# Altium project PCB_F2838_Node.PrjPcb (part 5 of 5)

## Sheet [8] CONNECTORS MECH.SchDoc
size 431 x 279 mm; SheetNumber: 9; SheetTotal: 9
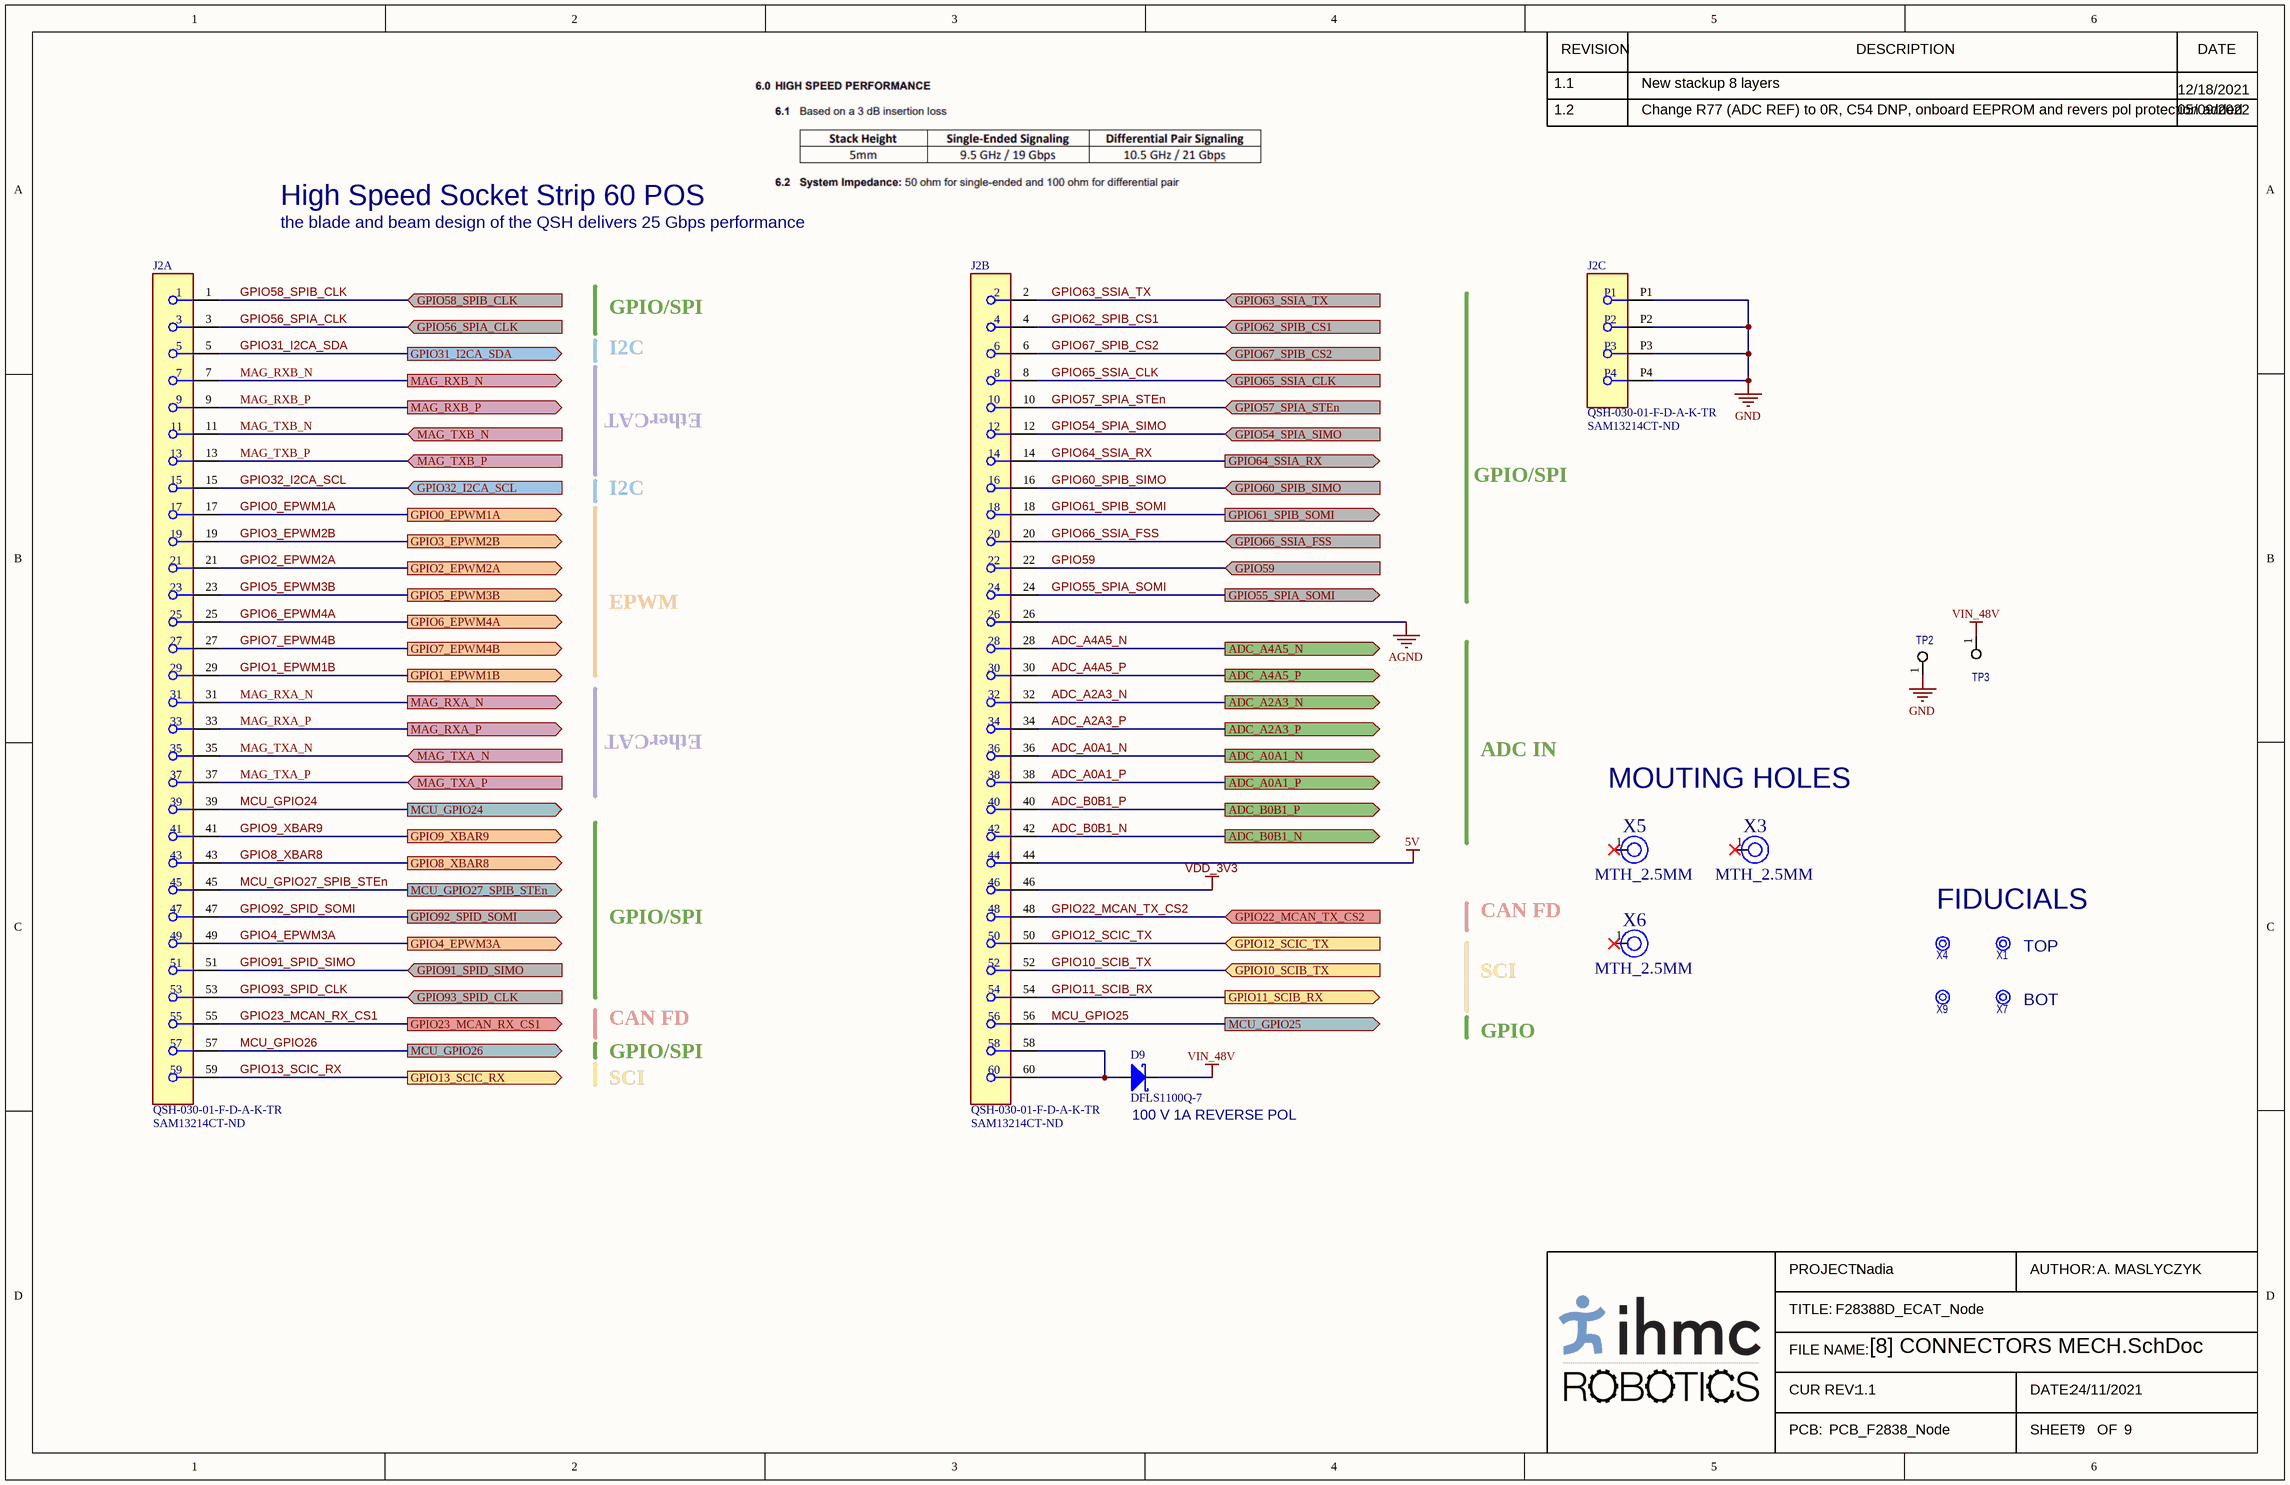
[diagram p8: [8] CONNECTORS MECH.SchDoc]

### Parts
D9  DFLS1100Q-7  [DI_123]
J2  QSH-030-01-F-D-A-K-TR  Supplier Part Number 1: SAM13214CT-ND  [FP-QSH-030-01-F-D-A-K-TR-MFG]  (parts A,B,C of 3)
TP2  TP_SMD  [TP_5019]  (value not drawn)  (no BOM)
TP3  TP_SMD  [TP_5019]  (value not drawn)  (no BOM)
X1  FIDUCIAL  [FIDUCIAL]  (value not drawn)  (no BOM)
X3  MTH_2.5MM  [MTH-M2.5mm]  (no BOM)
X4  FIDUCIAL  [FIDUCIAL]  (value not drawn)  (no BOM)
X5  MTH_2.5MM  [MTH-M2.5mm]  (no BOM)
X6  MTH_2.5MM  [MTH-M2.5mm]  (no BOM)
X7  FIDUCIAL  [FIDUCIAL]  (value not drawn)  (no BOM)
X9  FIDUCIAL  [FIDUCIAL]  (value not drawn)  (no BOM)

### Ports
ADC_A0A1_N (out), ADC_A0A1_P (out), ADC_A2A3_N (out), ADC_A2A3_P (out), ADC_A4A5_N (out), ADC_A4A5_P (out), ADC_B0B1_N (out), ADC_B0B1_P (out), GPIO0_EPWM1A (out), GPIO1_EPWM1B (out), GPIO2_EPWM2A (out), GPIO3_EPWM2B (out), GPIO4_EPWM3A (out), GPIO5_EPWM3B (out), GPIO6_EPWM4A (out), GPIO7_EPWM4B (out), GPIO8_XBAR8 (out), GPIO9_XBAR9 (out), GPIO10_SCIB_TX (in), GPIO11_SCIB_RX (out), GPIO12_SCIC_TX (in), GPIO13_SCIC_RX (out), GPIO22_MCAN_TX_CS2 (in), GPIO23_MCAN_RX_CS1 (out), GPIO31_I2CA_SDA (out), GPIO32_I2CA_SCL (in), GPIO54_SPIA_SIMO (in), GPIO55_SPIA_SOMI (out), GPIO56_SPIA_CLK (in), GPIO57_SPIA_STEn (in), GPIO58_SPIB_CLK (in), GPIO59 (in), GPIO60_SPIB_SIMO (in), GPIO61_SPIB_SOMI (out), GPIO62_SPIB_CS1 (in), GPIO63_SSIA_TX (in), GPIO64_SSIA_RX (out), GPIO65_SSIA_CLK (in), GPIO66_SSIA_FSS (in), GPIO67_SPIB_CS2 (in), GPIO91_SPID_SIMO (in), GPIO92_SPID_SOMI (out), GPIO93_SPID_CLK (in), MAG_RXA_N (out), MAG_RXA_P (out), MAG_RXB_N (out), MAG_RXB_P (out), MAG_TXA_N (in), MAG_TXA_P (in), MAG_TXB_N (in), MAG_TXB_P (in), MCU_GPIO24 (out), MCU_GPIO25 (out), MCU_GPIO26 (out), MCU_GPIO27_SPIB_STEn (out)

### Nets
5V: J2.44
AGND: J2.26
GND: J2.P1 J2.P2 J2.P3 J2.P4 TP2.1(IN)
VDD_3V3: J2.46
VIN_48V: D9.1(K) TP3.1(IN)
ADC_A0A1_N: J2.36 ; port ADC_A0A1_N
ADC_A0A1_P: J2.38 ; port ADC_A0A1_P
ADC_A2A3_N: J2.32 ; port ADC_A2A3_N
ADC_A2A3_P: J2.34 ; port ADC_A2A3_P
ADC_A4A5_N: J2.28 ; port ADC_A4A5_N
ADC_A4A5_P: J2.30 ; port ADC_A4A5_P
ADC_B0B1_N: J2.42 ; port ADC_B0B1_N
ADC_B0B1_P: J2.40 ; port ADC_B0B1_P
GPIO0_EPWM1A: J2.17 ; port GPIO0_EPWM1A
GPIO1_EPWM1B: J2.29 ; port GPIO1_EPWM1B
GPIO2_EPWM2A: J2.21 ; port GPIO2_EPWM2A
GPIO3_EPWM2B: J2.19 ; port GPIO3_EPWM2B
GPIO4_EPWM3A: J2.49 ; port GPIO4_EPWM3A
GPIO5_EPWM3B: J2.23 ; port GPIO5_EPWM3B
GPIO6_EPWM4A: J2.25 ; port GPIO6_EPWM4A
GPIO7_EPWM4B: J2.27 ; port GPIO7_EPWM4B
GPIO8_XBAR8: J2.43 ; port GPIO8_XBAR8
GPIO9_XBAR9: J2.41 ; port GPIO9_XBAR9
GPIO10_SCIB_TX: J2.52 ; port GPIO10_SCIB_TX
GPIO11_SCIB_RX: J2.54 ; port GPIO11_SCIB_RX
GPIO12_SCIC_TX: J2.50 ; port GPIO12_SCIC_TX
GPIO13_SCIC_RX: J2.59 ; port GPIO13_SCIC_RX
GPIO22_MCAN_TX_CS2: J2.48 ; port GPIO22_MCAN_TX_CS2
GPIO23_MCAN_RX_CS1: J2.55 ; port GPIO23_MCAN_RX_CS1
GPIO31_I2CA_SDA: J2.5 ; port GPIO31_I2CA_SDA
GPIO32_I2CA_SCL: J2.15 ; port GPIO32_I2CA_SCL
GPIO54_SPIA_SIMO: J2.12 ; port GPIO54_SPIA_SIMO
GPIO55_SPIA_SOMI: J2.24 ; port GPIO55_SPIA_SOMI
GPIO56_SPIA_CLK: J2.3 ; port GPIO56_SPIA_CLK
GPIO57_SPIA_STEn: J2.10 ; port GPIO57_SPIA_STEn
GPIO58_SPIB_CLK: J2.1 ; port GPIO58_SPIB_CLK
GPIO59: J2.22 ; port GPIO59
GPIO60_SPIB_SIMO: J2.16 ; port GPIO60_SPIB_SIMO
GPIO61_SPIB_SOMI: J2.18 ; port GPIO61_SPIB_SOMI
GPIO62_SPIB_CS1: J2.4 ; port GPIO62_SPIB_CS1
GPIO63_SSIA_TX: J2.2 ; port GPIO63_SSIA_TX
GPIO64_SSIA_RX: J2.14 ; port GPIO64_SSIA_RX
GPIO65_SSIA_CLK: J2.8 ; port GPIO65_SSIA_CLK
GPIO66_SSIA_FSS: J2.20 ; port GPIO66_SSIA_FSS
GPIO67_SPIB_CS2: J2.6 ; port GPIO67_SPIB_CS2
GPIO91_SPID_SIMO: J2.51 ; port GPIO91_SPID_SIMO
GPIO92_SPID_SOMI: J2.47 ; port GPIO92_SPID_SOMI
GPIO93_SPID_CLK: J2.53 ; port GPIO93_SPID_CLK
MAG_RXA_N: J2.31 ; port MAG_RXA_N
MAG_RXA_P: J2.33 ; port MAG_RXA_P
MAG_RXB_N: J2.7 ; port MAG_RXB_N
MAG_RXB_P: J2.9 ; port MAG_RXB_P
MAG_TXA_N: J2.35 ; port MAG_TXA_N
MAG_TXA_P: J2.37 ; port MAG_TXA_P
MAG_TXB_N: J2.11 ; port MAG_TXB_N
MAG_TXB_P: J2.13 ; port MAG_TXB_P
MCU_GPIO24: J2.39 ; port MCU_GPIO24
MCU_GPIO25: J2.56 ; port MCU_GPIO25
MCU_GPIO26: J2.57 ; port MCU_GPIO26
MCU_GPIO27_SPIB_STEn: J2.45 ; port MCU_GPIO27_SPIB_STEn
NetD9_2: D9.2(A) J2.58 J2.60

Not connected (* = marked no-connect by the designer): X3 1*; X5 1*; X6 1*

### Notes on the sheet
- High Speed Socket Strip 60 POS
- the blade and beam design of the QSH delivers 25 Gbps performance
- I2C
- GPIO/SPI
- EtherCAT
- EPWM
- ADC IN
- MOUTING HOLES
- CAN FD
- FIDUCIALS
- (near X1) TOP
- SCI
- (near X7) BOT
- GPIO
- (near D9) 100 V 1A REVERSE POL
- REVISION
- DESCRIPTION
- DATE
- PROJECT:
- AUTHOR:
- TITLE:
- FILE NAME:
- CUR REV:
- PCB:
- SHEET:
- DATE:
- OF

### Library data of the parts
D9 = DIODE_SCHOTTKY_100V_1A_DFLS1100Q-7: Rectifier Diode Schottky 100V 1A Automotive 2-Pin PowerDI 123 T/R; Manufacturer: Diodes; Supplier 1: Digi-Key; Manufacturer Part Number: DFLS1100Q-7; RoHS: Yes; Category: Rectifier Diodes; Stock 1: 12778; Pricing 1: 1=0.47000, 10=0.40100, 100=0.29960, 500=0.23540, 1000=0.18190 (USD); Mount: Surface Mount; Packaging: Tape and Reel; Average Rectified Current: 1A; Max Reverse Voltage (DC): 100V; RoHS Compliant: Yes; ComponentLink1URL: http://www.farnell.com/datasheets/2238295.pdf?src-supplier=Farnell; ComponentLink1Description: http://www.farnell.com/datasheets/2238295.pdf?src-supplier=Farnell; ComponentLink2URL: https://www.diodes.com/assets/Datasheets/ds30497.pdf?src-supplier=Digi-Key; ComponentLink2Description: https://www.diodes.com/assets/Datasheets/ds30497.pdf?src-supplier=Digi-Key; ComponentLink3URL: http://www.farnell.com/datasheets/2238295.pdf?src-supplier=Newark; ComponentLink3Description: http://www.farnell.com/datasheets/2238295.pdf?src-supplier=Newark; ComponentLink4URL: http://www.farnell.com/datasheets/2238295.pdf?src-supplier=Element14; ComponentLink4Description: http://www.farnell.com/datasheets/2238295.pdf?src-supplier=Element14; Supplier Part Number 1: DFLS1100Q-7DICT-ND
J2 = QSH-030-01-F-D-A_60PINS_CON: Conn Micro High Speed Socket Strip SKT 60 POS 0.5mm Solder ST SMD Automotive T/R; Manufacturer: Samtec; Voltage Rating (AC): 125V; Number of Contacts: 60; Gender: Female; Contact Plating: Gold; Pitch: 0.5mm; Housing Material: Polymer; Min Operating Temperature: -55°C; Termination: Solder; Radiation Hardening: No; Max Operating Temperature: 125°C; Length: 21.27mm; Depth: 7.49mm; Mount: Surface Mount; Max Voltage Rating (AC): 125V; Contact Material: Bronze; Lead Free: Lead Free; Orientation: Straight; Number of Rows: 2; Housing Color: Black; Packaging: Tape and Reel; Supplier 1: Digi-Key; Manufacturer Part Number: QSH-030-01-F-D-A-K-TR; RoHS: Yes; Category: Headers and Wire Housings; Stock 1: 520; Pricing 1: 1=9.59000, 10=9.17400, 25=8.34000, 50=7.92300, 100=7.71450, 250=6.88052 (USD); RoHS Compliant: Yes; ComponentLink1URL: https://datasheet.ciiva.com/9475/qsh-9475259.pdf?src-supplier=Avnet; ComponentLink1Description: https://datasheet.ciiva.com/9475/qsh-9475259.pdf?src-supplier=Avnet
TP2 TP3 = TP_SMD_1MM: Test point SMD
X3 X5 X6 = MTH_2.5MM: FORWARD_PCB: 1; STATUS: NOT INSTALLED; PKG_TYPE: MTH_2.5MM

## Nets that join several sheets
5V: [2] POWER (12 pins), [8] CONNECTORS MECH (J2.44)
AGND: [2] POWER (7 pins), [5] F2838 ADC (39 pins), [7] SENSORS (C48.1), [8] CONNECTORS MECH (J2.26)
GND: [2] POWER (128 pins), [4] F2838 JTAG CLOCK SUP (24 pins), [6] ETHERCAT (60 pins), [7] SENSORS (19 pins), [8] CONNECTORS MECH (5 pins)
VDD_1V2: [2] POWER (24 pins), [4] F2838 JTAG CLOCK SUP (U13.3)
VDD_3V3: [2] POWER (50 pins), [4] F2838 JTAG CLOCK SUP (28 pins), [6] ETHERCAT (73 pins), [7] SENSORS (13 pins), [8] CONNECTORS MECH (J2.46)
VDDA_3V3: [2] POWER (6 pins), [5] F2838 ADC (7 pins)
VIN_48V: [2] POWER (5 pins), [8] CONNECTORS MECH (D9.1 TP3.1)
ADC_A0A1_N: [5] F2838 ADC (R86.1), [8] CONNECTORS MECH (J2.36)
ADC_A0A1_P: [5] F2838 ADC (R87.1), [8] CONNECTORS MECH (J2.38)
ADC_A2A3_N: [5] F2838 ADC (R84.1), [8] CONNECTORS MECH (J2.32)
ADC_A2A3_P: [5] F2838 ADC (R85.1), [8] CONNECTORS MECH (J2.34)
ADC_A4A5_N: [5] F2838 ADC (R82.1), [8] CONNECTORS MECH (J2.28)
ADC_A4A5_P: [5] F2838 ADC (R83.1), [8] CONNECTORS MECH (J2.30)
ADC_B0B1_N: [5] F2838 ADC (R81.1), [8] CONNECTORS MECH (J2.42)
ADC_B0B1_P: [5] F2838 ADC (R88.1), [8] CONNECTORS MECH (J2.40)
GPIO0_EPWM1A: [3] F2838 GPIO (U8.C8), [8] CONNECTORS MECH (J2.17)
GPIO1_EPWM1B: [3] F2838 GPIO (U8.D8), [8] CONNECTORS MECH (J2.29)
GPIO2_EPWM2A: [3] F2838 GPIO (U8.A7), [8] CONNECTORS MECH (J2.21)
GPIO3_EPWM2B: [3] F2838 GPIO (U8.B7), [8] CONNECTORS MECH (J2.19)
GPIO4_EPWM3A: [3] F2838 GPIO (U8.C7), [8] CONNECTORS MECH (J2.49)
GPIO5_EPWM3B: [3] F2838 GPIO (U8.D7), [8] CONNECTORS MECH (J2.23)
GPIO6_EPWM4A: [3] F2838 GPIO (U8.A6), [8] CONNECTORS MECH (J2.25)
GPIO7_EPWM4B: [3] F2838 GPIO (U8.B6), [8] CONNECTORS MECH (J2.27)
GPIO8_XBAR8: [3] F2838 GPIO (U8.G2), [8] CONNECTORS MECH (J2.43)
GPIO9_XBAR9: [3] F2838 GPIO (U8.G3), [8] CONNECTORS MECH (J2.41)
GPIO10_SCIB_TX: [3] F2838 GPIO (U8.B2), [8] CONNECTORS MECH (J2.52)
GPIO11_SCIB_RX: [3] F2838 GPIO (U8.C1), [8] CONNECTORS MECH (J2.54)
GPIO12_SCIC_TX: [3] F2838 GPIO (U8.C2), [8] CONNECTORS MECH (J2.50)
GPIO13_SCIC_RX: [3] F2838 GPIO (U8.D1), [8] CONNECTORS MECH (J2.59)
GPIO22_MCAN_TX_CS2: [3] F2838 GPIO (U8.J4), [8] CONNECTORS MECH (J2.48)
GPIO23_MCAN_RX_CS1: [3] F2838 GPIO (U8.K4), [8] CONNECTORS MECH (J2.55)
GPIO28_PWM15_LED_RED: [3] F2838 GPIO (U8.V11), [4] F2838 JTAG CLOCK SUP (R18.1 U3.3)
GPIO29_PWM15_LED_GR: [3] F2838 GPIO (U8.W11), [4] F2838 JTAG CLOCK SUP (R14.1 U3.1)
GPIO31_I2CA_SDA: [3] F2838 GPIO (U8.U11), [8] CONNECTORS MECH (J2.5)
GPIO32_I2CA_SCL: [3] F2838 GPIO (U8.U13), [8] CONNECTORS MECH (J2.15)
GPIO34_I2CB_IMU_SDA: [3] F2838 GPIO (U8.U14), [7] SENSORS (R99.1 R102.1 U15.5)
GPIO35_I2CB_IMU_SCL: [3] F2838 GPIO (U8.T14), [7] SENSORS (R98.1 R100.2 R103.1)
GPIO51_OVERVOLTAGE: [3] F2838 GPIO (U8.R19), [4] F2838 JTAG CLOCK SUP (R76.2)
GPIO54_SPIA_SIMO: [3] F2838 GPIO (U8.P18), [8] CONNECTORS MECH (J2.12)
GPIO55_SPIA_SOMI: [3] F2838 GPIO (U8.P19), [8] CONNECTORS MECH (J2.24)
GPIO56_SPIA_CLK: [3] F2838 GPIO (U8.N16), [8] CONNECTORS MECH (J2.3)
GPIO57_SPIA_STEn: [3] F2838 GPIO (U8.N18), [8] CONNECTORS MECH (J2.10)
GPIO58_SPIB_CLK: [3] F2838 GPIO (U8.N17), [8] CONNECTORS MECH (J2.1)
GPIO59: [3] F2838 GPIO (U8.M16), [8] CONNECTORS MECH (J2.22)
GPIO60_SPIB_SIMO: [3] F2838 GPIO (U8.M17), [8] CONNECTORS MECH (J2.16)
GPIO61_SPIB_SOMI: [3] F2838 GPIO (U8.L16), [8] CONNECTORS MECH (J2.18)
GPIO62_SPIB_CS1: [3] F2838 GPIO (U8.J17), [8] CONNECTORS MECH (J2.4)
GPIO63_SSIA_TX: [3] F2838 GPIO (U8.J16), [8] CONNECTORS MECH (J2.2)
GPIO64_SSIA_RX: [3] F2838 GPIO (U8.L17), [8] CONNECTORS MECH (J2.14)
GPIO65_SSIA_CLK: [3] F2838 GPIO (U8.K16), [8] CONNECTORS MECH (J2.8)
GPIO66_SSIA_FSS: [3] F2838 GPIO (U8.K17), [8] CONNECTORS MECH (J2.20)
GPIO67_SPIB_CS2: [3] F2838 GPIO (U8.B19), [8] CONNECTORS MECH (J2.6)
GPIO91_SPID_SIMO: [3] F2838 GPIO (U8.B5), [8] CONNECTORS MECH (J2.51)
GPIO92_SPID_SOMI: [3] F2838 GPIO (U8.A4), [8] CONNECTORS MECH (J2.47)
GPIO93_SPID_CLK: [3] F2838 GPIO (U8.B4), [8] CONNECTORS MECH (J2.53)
GPIO98_SPIC_CS1: [3] F2838 GPIO (U8.F1), [7] SENSORS (U14.12)
GPIO100_SPIC_SIMO: [3] F2838 GPIO (U8.H1), [7] SENSORS (R102.2 U14.14)
GPIO101_SPIC_SOMI: [3] F2838 GPIO (U8.H2), [7] SENSORS (U14.1)
GPIO102_SPIC_CLK: [3] F2838 GPIO (U8.H3), [7] SENSORS (R103.2 U14.13)
GPIO104_IMU_INT1: [3] F2838 GPIO (U8.J2), [7] SENSORS (U14.4)
GPIO105_IMU_INT2: [3] F2838 GPIO (U8.J3), [7] SENSORS (R105.1 U14.9)
GPIO129_ESC_TX1_ENA: [3] F2838 GPIO (U8.T10), [6] ETHERCAT (U6.3)
GPIO130_ESC_TX1_CLK: [3] F2838 GPIO (U8.U10), [6] ETHERCAT (U6.2)
GPIO131_ESC_TX1_DATA0: [3] F2838 GPIO (U8.V10), [6] ETHERCAT (U6.4)
GPIO132_ESC_TX1_DATA1: [3] F2838 GPIO (U8.W18), [6] ETHERCAT (U6.5)
GPIO134_ESC_TX1_DATA2: [3] F2838 GPIO (U8.V18), [6] ETHERCAT (U6.6)
GPIO135_ESC_TX1_DATA3: [3] F2838 GPIO (U8.U18), [6] ETHERCAT (U6.7)
GPIO136_ESC_RX1_DV: [3] F2838 GPIO (U8.T17), [6] ETHERCAT (R49.2 U6.26)
GPIO137_ESC_RX1_CLK: [3] F2838 GPIO (U8.T18), [6] ETHERCAT (U6.25)
GPIO138_ESC_RX1_ERR: [3] F2838 GPIO (U8.T19), [6] ETHERCAT (R56.1 U6.28)
GPIO139_ESC_RX1_DATA0: [3] F2838 GPIO (U8.N19), [6] ETHERCAT (R51.2 U6.30)
GPIO140_ESC_RX1_DATA1: [3] F2838 GPIO (U8.M19), [6] ETHERCAT (R52.2 U6.31)
GPIO141_ESC_RX1_DATA2: [3] F2838 GPIO (U8.M18), [6] ETHERCAT (R53.2 U6.32)
GPIO142_ESC_RX1_DATA3: [3] F2838 GPIO (U8.L19), [6] ETHERCAT (R54.2 U6.1)
GPIO143_ESC_LED_LINK0_ACTIVE: [3] F2838 GPIO (U8.F18), [6] ETHERCAT (D4.3)
GPIO144_ESC_LED_LINK1_ACTIVE: [3] F2838 GPIO (U8.F17), [6] ETHERCAT (D5.3)
GPIO145_ESC_LED_ERR: [3] F2838 GPIO (U8.E17), [6] ETHERCAT (R90.2 U12.1)
GPIO146_ESC_LED_RUN: [3] F2838 GPIO (U8.D18), [6] ETHERCAT (R89.2 U12.3)
GPIO148_ESC_PHY0_LINKSTATUS: [3] F2838 GPIO (U8.D14), [6] ETHERCAT (D4.4 R39.1 U5.17)
GPIO149_ESC_PHY1_LINKSTATUS: [3] F2838 GPIO (U8.A13), [6] ETHERCAT (D5.4 R40.1 U6.17)
GPIO150_ESC_I2C_SDA: [3] F2838 GPIO (U8.B13), [6] ETHERCAT (R35.1 U4.5)
GPIO151_ESC_I2C_SCL: [3] F2838 GPIO (U8.C13), [6] ETHERCAT (R36.1 U4.6)
GPIO152_ESC_MDIO_CLK: [3] F2838 GPIO (U8.D13), [6] ETHERCAT (U5.20 U6.20)
GPIO153_ESC_MDIO_DATA: [3] F2838 GPIO (U8.A12), [6] ETHERCAT (R41.1 R42.1 U5.19 U6.19)
GPIO154_P0_PHY_CLK: [3] F2838 GPIO (U8.B12), [4] F2838 JTAG CLOCK SUP (R43.2 R47.2)
GPIO155_ESC_PHY_RESETn: [3] F2838 GPIO (U8.C12), [6] ETHERCAT (U5.18 U6.18)
GPIO156_ESC_TX0_ENA: [3] F2838 GPIO (U8.D12), [6] ETHERCAT (U5.3)
GPIO157_ESC_TX0_CLK: [3] F2838 GPIO (U8.B10), [6] ETHERCAT (U5.2)
GPIO158_ESC_TX0_DATA0: [3] F2838 GPIO (U8.C10), [6] ETHERCAT (U5.4)
GPIO159_ESC_TX0_DATA1: [3] F2838 GPIO (U8.D10), [6] ETHERCAT (U5.5)
GPIO160_ESC_TX0_DATA2: [3] F2838 GPIO (U8.B9), [6] ETHERCAT (U5.6)
GPIO161_ESC_TX0_DATA3: [3] F2838 GPIO (U8.C9), [6] ETHERCAT (U5.7)
GPIO162_ESC_RX0_DV: [3] F2838 GPIO (U8.D9), [6] ETHERCAT (R57.2 U5.26)
GPIO163_ESC_RX0_CLK: [3] F2838 GPIO (U8.A8), [6] ETHERCAT (U5.25)
GPIO164_ESC_RX0_ERR: [3] F2838 GPIO (U8.B8), [6] ETHERCAT (R59.1 U5.28)
GPIO165_ESC_RX0_DATA0: [3] F2838 GPIO (U8.C5), [6] ETHERCAT (R61.2 U5.30)
GPIO166_ESC_RX0_DATA1: [3] F2838 GPIO (U8.D5), [6] ETHERCAT (R62.2 U5.31)
GPIO167_ESC_RX0_DATA2: [3] F2838 GPIO (U8.C4), [6] ETHERCAT (R63.2 U5.32)
GPIO168_ESC_RX0_DATA3: [3] F2838 GPIO (U8.D4), [6] ETHERCAT (R64.2 U5.1)
MAG_RXA_N: [6] ETHERCAT (L6.3), [8] CONNECTORS MECH (J2.31)
MAG_RXA_P: [6] ETHERCAT (L6.2), [8] CONNECTORS MECH (J2.33)
MAG_RXB_N: [6] ETHERCAT (L4.3), [8] CONNECTORS MECH (J2.7)
MAG_RXB_P: [6] ETHERCAT (L4.2), [8] CONNECTORS MECH (J2.9)
MAG_TXA_N: [6] ETHERCAT (L7.3), [8] CONNECTORS MECH (J2.35)
MAG_TXA_P: [6] ETHERCAT (L7.2), [8] CONNECTORS MECH (J2.37)
MAG_TXB_N: [6] ETHERCAT (L5.3), [8] CONNECTORS MECH (J2.11)
MAG_TXB_P: [6] ETHERCAT (L5.2), [8] CONNECTORS MECH (J2.13)
MCU_GPIO24: [3] F2838 GPIO (U8.K3), [8] CONNECTORS MECH (J2.39)
MCU_GPIO25: [3] F2838 GPIO (U8.K2), [8] CONNECTORS MECH (J2.56)
MCU_GPIO26: [3] F2838 GPIO (U8.K1), [8] CONNECTORS MECH (J2.57)
MCU_GPIO27_SPIB_STEn: [3] F2838 GPIO (U8.L1), [8] CONNECTORS MECH (J2.45)
MCU_GPIO72_BOOT1: [3] F2838 GPIO (U8.B16), [4] F2838 JTAG CLOCK SUP (R79.1)
MCU_GPIO84_BOOT2: [3] F2838 GPIO (U8.A11), [4] F2838 JTAG CLOCK SUP (R80.1)
P0_PHY_CLK: [4] F2838 JTAG CLOCK SUP (R43.1 R45.2), [6] ETHERCAT (U5.23)
P1_PHY_CLK: [4] F2838 JTAG CLOCK SUP (R44.2 R47.1), [6] ETHERCAT (U6.23)
T_AMB1_ADC_B2: [5] F2838 ADC (U8.V3), [7] SENSORS (C48.2 R65.2)

## Assembly variants
REV1.0: not fitted C1 C2 C3 C4 C5 C6 C7 C8 C22 C23 C112 R5 R43 R47 R70 R72 R75 R76 R98 R99 R102 R103 R105 R109 R110 TP2 TP3
REV1.1: not fitted C1 C2 C3 C4 C5 C6 C7 C8 C22 C23 C112 R5 R43 R47 R70 R72 R75 R76 R98 R99 R102 R103 R105 R109 R110 TP2 TP3
REV1.2: not fitted C1 C2 C3 C4 C5 C6 C7 C8 C22 C23 C54 C112 R5 R43 R47 R70 R72 R75 R76 R98 R99 R102 R103 R105 R109 R110 TP2 TP3